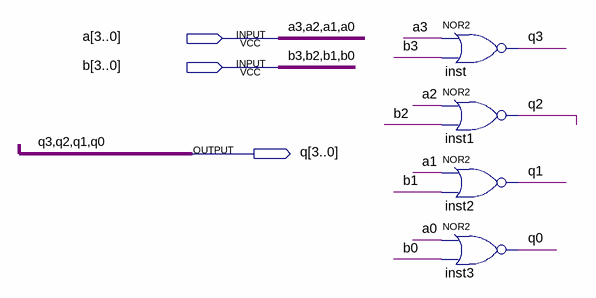
[diagram p0: schematic sheet]
// Quartus schematic s_nor4.bdf as structural Verilog: 4 symbols, 3 pins
module s_nor4 (
  input  [3:0] a,
  input  [3:0] b,
  output [3:0] q
);

  nor inst (q[3], a[3], b[3]);
  nor inst1 (q[2], a[2], b[2]);
  nor inst2 (q[1], a[1], b[1]);
  nor inst3 (q[0], a[0], b[0]);
endmodule
